# Altium project PCBX-1.PrjPcb
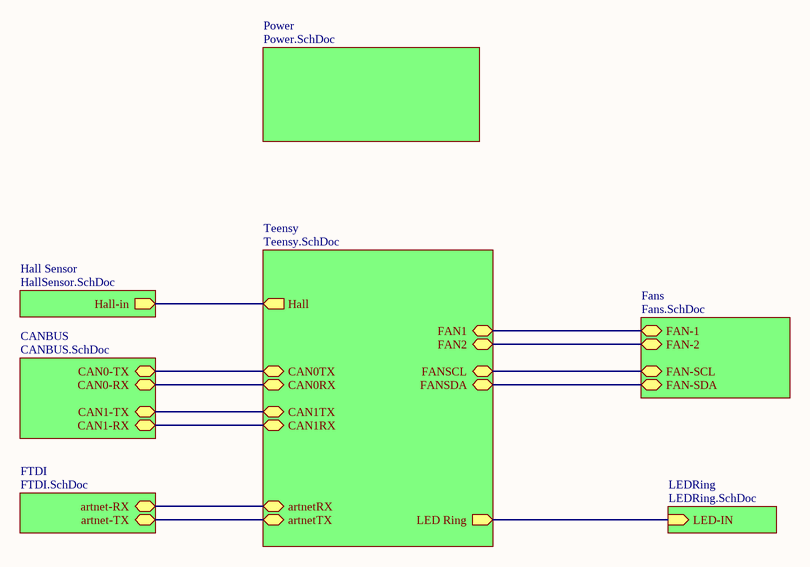
[diagram p0: LX1_v1.SchDoc]
11 sheets, 112 parts. Net scope: hierarchical (ports join the sheet entries above them; power ports are global).
Sheets:
  LX1_v1.SchDoc
    Teensy = Teensy.SchDoc
    LEDRing = LEDRing.SchDoc
    Fans = Fans.SchDoc
    FTDI = FTDI.SchDoc
    Power = Power.SchDoc
    Hall Sensor = HallSensor.SchDoc
    CANBUS = CANBUS.SchDoc
  ODrive.SchDoc
  RZ120.SchDoc
  PowerOld.SchDoc

## Sheet LX1_v1.SchDoc: LX-1
size A4; Organization: Carbon Video Systems; Address1: 1265 Powell Street; Address2: Vancouver, BC; Address3: Canada; Revision: 0.1; SheetNumber: 1

### Sub-sheets
CANBUS = CANBUS.SchDoc: CAN0-TX, CAN0-RX, CAN1-TX, CAN1-RX
Fans = Fans.SchDoc: FAN-1, FAN-2, FAN-SCL, FAN-SDA
FTDI = FTDI.SchDoc: artnet-RX, artnet-TX
Hall Sensor = HallSensor.SchDoc: Hall-in
LEDRing = LEDRing.SchDoc: LED-IN (in)
Power = Power.SchDoc: no entries
Teensy = Teensy.SchDoc: LED Ring (out), FAN1, FAN2, FANSDA, FANSCL, artnetTX, artnetRX, Hall, CAN0TX, CAN0RX, CAN1TX, CAN1RX

### Nets
NetARM_Teensy_A5: sheet Teensy/LED Ring, sheet LEDRing/LED-IN
NetARM_Teensy_A8: sheet Teensy/Hall, sheet Hall Sensor/Hall-in
NetARM_Teensy_A9: sheet Teensy/artnetTX, sheet FTDI/artnet-TX
NetARM_Teensy_A11: sheet Teensy/artnetRX, sheet FTDI/artnet-RX
NetARM_Teensy_D11: sheet Teensy/FAN2, sheet Fans/FAN-2
NetARM_Teensy_D12: sheet Teensy/FAN1, sheet Fans/FAN-1
NetARM_Teensy_G11: sheet Teensy/FANSDA, sheet Fans/FAN-SDA
NetARM_Teensy_G12: sheet Teensy/FANSCL, sheet Fans/FAN-SCL
NetARM_Teensy_J9: sheet Teensy/CAN0RX, sheet CANBUS/CAN0-RX
NetARM_Teensy_K5: sheet Teensy/CAN1RX, sheet CANBUS/CAN1-RX
NetARM_Teensy_K9: sheet Teensy/CAN0TX, sheet CANBUS/CAN0-TX
NetARM_Teensy_M4: sheet Teensy/CAN1TX, sheet CANBUS/CAN1-TX

### Notes on the sheet
- Title
- Size:
- Date:
- A4
- Number:
- Time:
- Revision:
- Sheet
- of
- File:

## Sheet Teensy.SchDoc
size A2; Organization: Altium Limited; Address1: L3, 12a Rodborough Rd; Address2: Frenchs Forest; Address3: NSW; Address4: Australia 2086
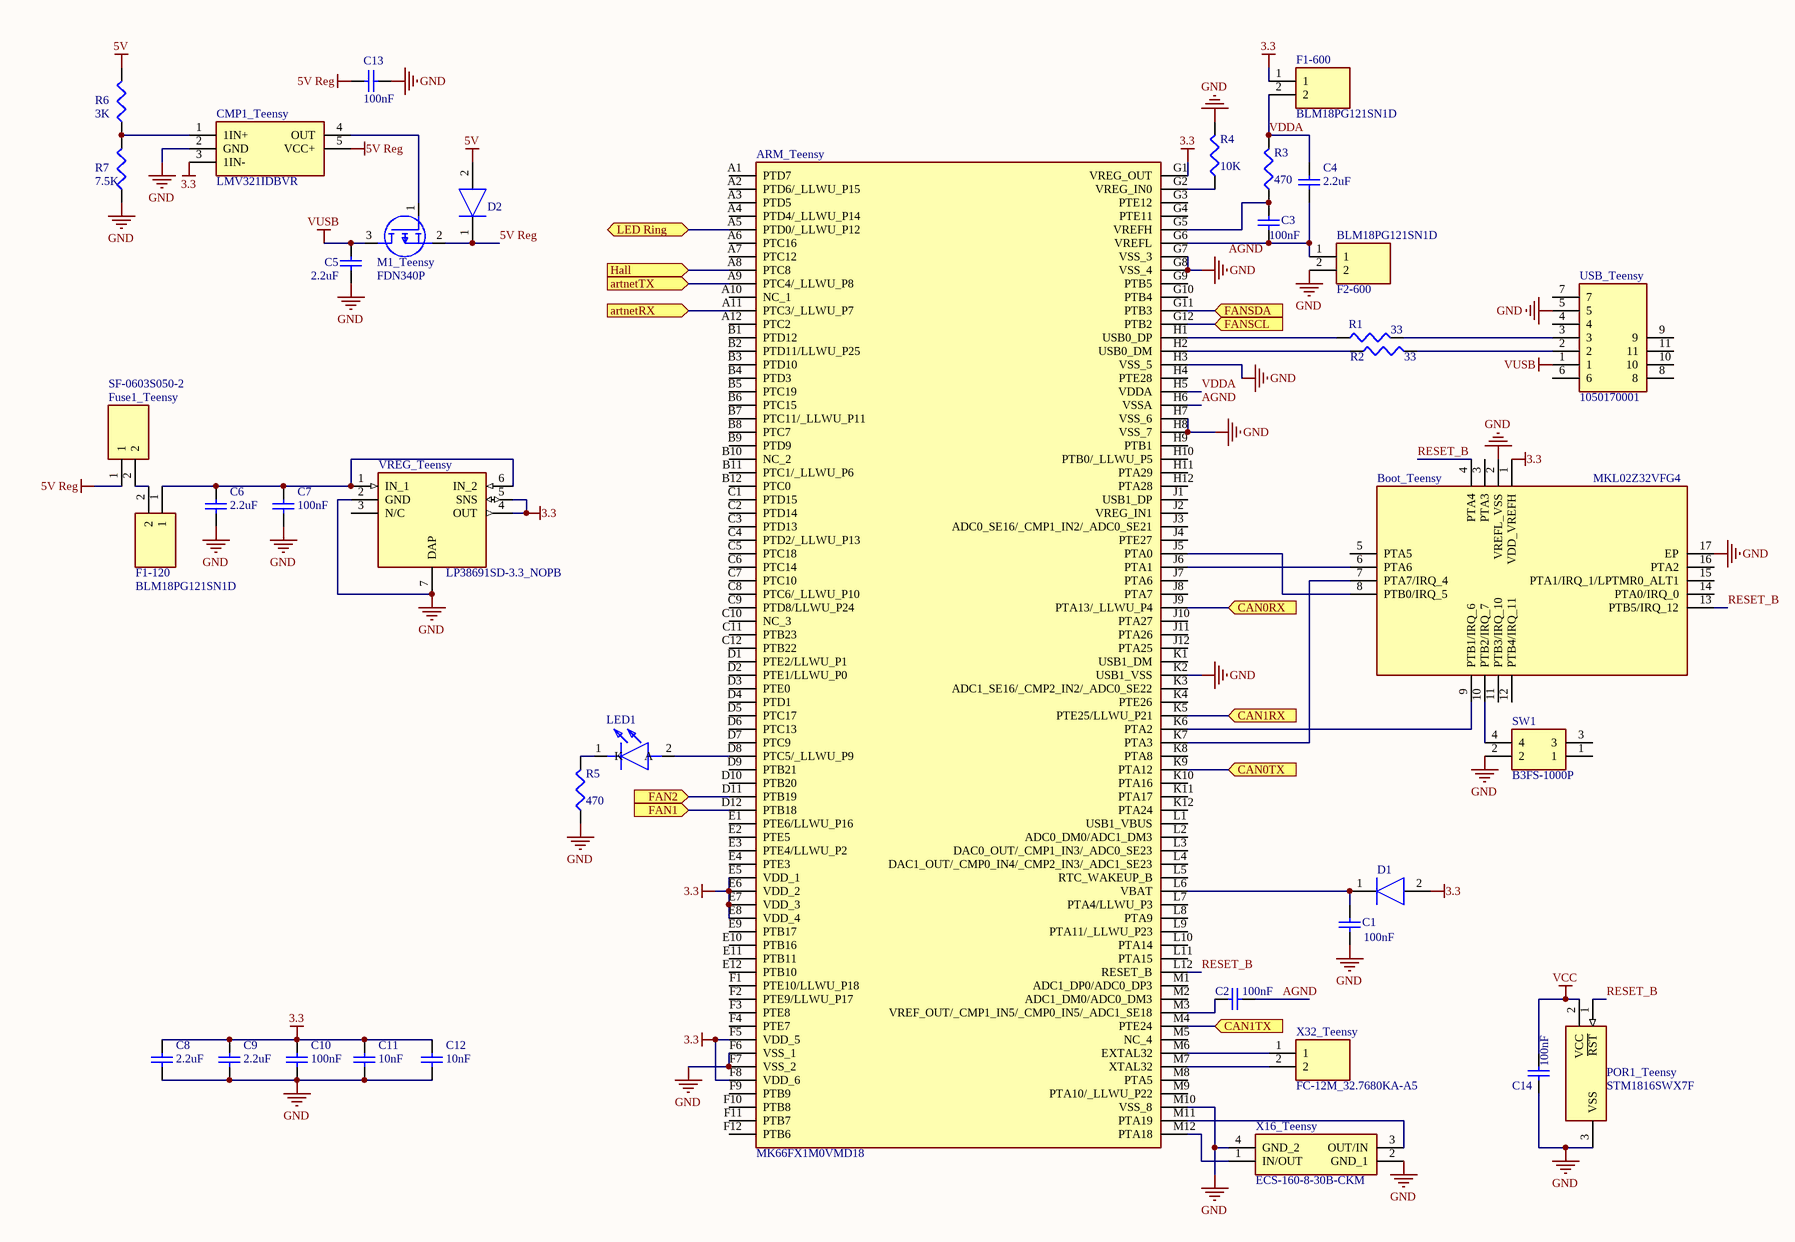
[diagram p1: Teensy.SchDoc]

### Parts
ARM_Teensy  MK66FX1M0VMD18  [BGA144C100P12X12_1300X1300X170]
Boot_Teensy  MKL02Z32VFG4  [QFN50P300X300X65-17N-D]
C1  value 100nF  [1608[0603]]  (hidden comment: Cap Semi)
C2  value 100nF  [1608[0603]]  (hidden comment: Cap Semi)
C3  value 100nF  [1608[0603]]  (hidden comment: Cap Semi)
C4  value 2.2uF  [1608[0603]]  (hidden comment: Cap Semi)
C5  value 2.2uF  [1608[0603]]  (hidden comment: Cap Semi)
C6  value 2.2uF  [1608[0603]]  (hidden comment: Cap Semi)
C7  value 100nF  [1608[0603]]  (hidden comment: Cap Semi)
C8  value 2.2uF  [1608[0603]]  (hidden comment: Cap Semi)
C9  value 2.2uF  [1608[0603]]  (hidden comment: Cap Semi)
C10  value 100nF  [1608[0603]]  (hidden comment: Cap Semi)
C11  value 10nF  [1608[0603]]  (hidden comment: Cap Semi)
C12  value 10nF  [1608[0603]]  (hidden comment: Cap Semi)
C13  value 100nF  [1608[0603]]  (hidden comment: Cap Semi)
C14  value 100nF  [1608[0603]]  (hidden comment: Cap Semi)
CMP1_Teensy  LMV321IDBVR  [SOT95P280X145-5N]
D1  NRVTS260ESFT1G  [SODFL3616X98N]  (value not drawn)
D2  NRVTS260ESFT1G  [SODFL3616X98N]  (value not drawn)
F1-120  BLM18PG121SN1D  [BEADC1608X95N]
F1-600  BLM18PG121SN1D  [BEADC1608X95N]
F2-600  BLM18PG121SN1D  [BEADC1608X95N]
Fuse1_Teensy  SF-0603S050-2  [FUSC1608X55N]
LED1  HSMC-C190  [LEDC1608X90N]  (value not drawn)
M1_Teensy  FDN340P  [SOT95P237X112-3N]
POR1_Teensy  STM1816SWX7F  [SOT103P237X112-3N]
R1  value 33  [J1-0603]  (hidden comment: Res3)
R2  value 33  [J1-0603]  (hidden comment: Res3)
R3  value 470  [J1-0603]  (hidden comment: Res3)
R4  value 10K  [J1-0603]  (hidden comment: Res3)
R5  value 470  [J1-0603]  (hidden comment: Res3)
R6  value 3K  [J1-0603]  (hidden comment: Res3)
R7  value 7.5K  [J1-0603]  (hidden comment: Res3)
SW1  B3FS-1000P  [B3FS-1000P]
USB_Teensy  1050170001  [MICROUSB-BTYPE]
VREG_Teensy  LP38691SD-3.3_NOPB  [SON95P300X300X80-7N]
X16_Teensy  ECS-160-8-30B-CKM  [ECS801830BAGNTR]
X32_Teensy  FC-12M_32.7680KA-A5  [FC12M327680KAA5]

### Ports
artnetRX, artnetTX, CAN0RX, CAN0TX, CAN1RX, CAN1TX, FAN1, FAN2, FANSCL, FANSDA, Hall, LED Ring

### Nets
3.3: ARM_Teensy.E5(VDD_1) ARM_Teensy.E6(VDD_2) ARM_Teensy.E7(VDD_3) ARM_Teensy.E8(VDD_4) ARM_Teensy.F5(VDD_5) ARM_Teensy.F8(VDD_6) ARM_Teensy.G1(VREG_OUT) Boot_Teensy.1(VDD_VREFH) C8.2 C9.2 C10.2 C11.2 C12.2 CMP1_Teensy.3(1IN-) D1.2(A) F1-600.1 VREG_Teensy.4(OUT) VREG_Teensy.5(SNS)
5V: D2.2(A) R6.2
5V Reg: C13.2 CMP1_Teensy.5(VCC+) D2.1(K) Fuse1_Teensy.1 M1_Teensy.2(S)
GND: ARM_Teensy.F6(VSS_1) ARM_Teensy.F7(VSS_2) ARM_Teensy.G7(VSS_3) ARM_Teensy.G8(VSS_4) ARM_Teensy.H3(VSS_5) ARM_Teensy.H7(VSS_6) ARM_Teensy.H8(VSS_7) ARM_Teensy.K2(USB1_VSS) ARM_Teensy.M10(VSS_8) Boot_Teensy.2(VREFL_VSS) Boot_Teensy.17(EP) C1.1 C5.2 C6.1 C7.1 C8.1 C9.1 C10.1 C11.1 C12.1 C13.1 C14.1 CMP1_Teensy.2(GND) F2-600.2 POR1_Teensy.3(VSS) R4.2 R5.1 R7.1 SW1.2 USB_Teensy.5 VREG_Teensy.2(GND) VREG_Teensy.7(DAP) X16_Teensy.2(GND_1) X16_Teensy.4(GND_2)
VCC: C14.2 POR1_Teensy.2(VCC)
VUSB: C5.1 M1_Teensy.3(D) USB_Teensy.1
AGND: ARM_Teensy.H6(VSSA) C2.2
RESET_B: ARM_Teensy.L12(RESET_B) Boot_Teensy.4(PTA4) Boot_Teensy.13(PTB5/IRQ_12) POR1_Teensy.1(~{RST})
VDDA: ARM_Teensy.H5(VDDA) C4.2 F1-600.2 R3.2
NetARM_Teensy_A5: ARM_Teensy.A5(PTD0/_LLWU_P12) ; port LED Ring
NetARM_Teensy_A8: ARM_Teensy.A8(PTC8) ; port Hall
NetARM_Teensy_A9: ARM_Teensy.A9(PTC4/_LLWU_P8) ; port artnetTX
NetARM_Teensy_A11: ARM_Teensy.A11(PTC3/_LLWU_P7) ; port artnetRX
NetARM_Teensy_D8: ARM_Teensy.D8(PTC5/_LLWU_P9) LED1.2(A)
NetARM_Teensy_D11: ARM_Teensy.D11(PTB19) ; port FAN2
NetARM_Teensy_D12: ARM_Teensy.D12(PTB18) ; port FAN1
NetARM_Teensy_G2: ARM_Teensy.G2(VREG_IN0) R4.1
NetARM_Teensy_G5: ARM_Teensy.G5(VREFH) C3.2 R3.1
NetARM_Teensy_G6: ARM_Teensy.G6(VREFL) C3.1 C4.1 F2-600.1
NetARM_Teensy_G11: ARM_Teensy.G11(PTB3) ; port FANSDA
NetARM_Teensy_G12: ARM_Teensy.G12(PTB2) ; port FANSCL
NetARM_Teensy_H1: ARM_Teensy.H1(USB0_DP) R1.1
NetARM_Teensy_H2: ARM_Teensy.H2(USB0_DM) R2.1
NetARM_Teensy_J5: ARM_Teensy.J5(PTA0) Boot_Teensy.8(PTB0/IRQ_5)
NetARM_Teensy_J6: ARM_Teensy.J6(PTA1) Boot_Teensy.6(PTA6)
NetARM_Teensy_J9: ARM_Teensy.J9(PTA13/_LLWU_P4) ; port CAN0RX
NetARM_Teensy_K5: ARM_Teensy.K5(PTE25/LLWU_P21) ; port CAN1RX
NetARM_Teensy_K6: ARM_Teensy.K6(PTA2) Boot_Teensy.9(PTB1/IRQ_6)
NetARM_Teensy_K7: ARM_Teensy.K7(PTA3) Boot_Teensy.7(PTA7/IRQ_4)
NetARM_Teensy_K9: ARM_Teensy.K9(PTA12) ; port CAN0TX
NetARM_Teensy_L6: ARM_Teensy.L6(VBAT) C1.2 D1.1(K)
NetARM_Teensy_M3: ARM_Teensy.M3(VREF_OUT/_CMP1_IN5/_CMP0_IN5/_ADC1_SE18) C2.1
NetARM_Teensy_M4: ARM_Teensy.M4(PTE24) ; port CAN1TX
NetARM_Teensy_M6: ARM_Teensy.M6(EXTAL32) X32_Teensy.1
NetARM_Teensy_M7: ARM_Teensy.M7(XTAL32) X32_Teensy.2
NetARM_Teensy_M11: ARM_Teensy.M11(PTA19) X16_Teensy.3(OUT/IN)
NetARM_Teensy_M12: ARM_Teensy.M12(PTA18) X16_Teensy.1(IN/OUT)
NetBoot_Teensy_10: Boot_Teensy.10(PTB2/IRQ_7) SW1.4
NetC6_2: C6.2 C7.2 F1-120.1 VREG_Teensy.1(IN_1) VREG_Teensy.6(IN_2)
NetCMP1_Teensy_1: CMP1_Teensy.1(1IN+) R6.1 R7.2
NetCMP1_Teensy_4: CMP1_Teensy.4(OUT) M1_Teensy.1(G)
NetF1-120_2: F1-120.2 Fuse1_Teensy.2
NetLED1_1: LED1.1(K) R5.2
NetR1_2: R1.2 USB_Teensy.3
NetR2_2: R2.2 USB_Teensy.2

Not connected (* = marked no-connect by the designer): ARM_Teensy A1(PTD7) A2(PTD6/_LLWU_P15) A3(PTD5) A4(PTD4/_LLWU_P14) A6(PTC16) A7(PTC12) A10(NC_1) A12(PTC2) B1(PTD12) B2(PTD11/LLWU_P25) B3(PTD10) B4(PTD3) B5(PTC19) B6(PTC15) B7(PTC11/_LLWU_P11) B8(PTC7) B9(PTD9) B10(NC_2) B11(PTC1/_LLWU_P6) B12(PTC0) C1(PTD15) C2(PTD14) C3(PTD13) C4(PTD2/_LLWU_P13) C5(PTC18) C6(PTC14) C7(PTC10) C8(PTC6/_LLWU_P10) C9(PTD8/LLWU_P24) C10(NC_3) C11(PTB23) C12(PTB22) D1(PTE2/LLWU_P1) D2(PTE1/LLWU_P0) D3(PTE0) D4(PTD1) D5(PTC17) D6(PTC13) D7(PTC9) D9(PTB21) D10(PTB20) E1(PTE6/LLWU_P16) E2(PTE5) E3(PTE4/LLWU_P2) E4(PTE3) E9(PTB17) E10(PTB16) E11(PTB11) E12(PTB10) F1(PTE10/LLWU_P18) F2(PTE9/LLWU_P17) F3(PTE8) F4(PTE7) F9(PTB9) F10(PTB8) F11(PTB7) F12(PTB6) G3(PTE12) G4(PTE11) G9(PTB5) G10(PTB4) H4(PTE28) H9(PTB1) H10(PTB0/_LLWU_P5) H11(PTA29) H12(PTA28) J1(USB1_DP) J2(VREG_IN1) J3(ADC0_SE16/_CMP1_IN2/_ADC0_SE21) J4(PTE27) J7(PTA6) J8(PTA7) J10(PTA27) J11(PTA26) J12(PTA25) K1(USB1_DM) K3(ADC1_SE16/_CMP2_IN2/_ADC0_SE22) K4(PTE26) K8(PTA8) K10(PTA16) K11(PTA17) K12(PTA24) L1(USB1_VBUS) L2(ADC0_DM0/ADC1_DM3) L3(DAC0_OUT/_CMP1_IN3/_ADC0_SE23) L4(DAC1_OUT/_CMP0_IN4/_CMP2_IN3/_ADC1_SE23) L5(RTC_WAKEUP_B) L7(PTA4/LLWU_P3) L8(PTA9) L9(PTA11/_LLWU_P23) L10(PTA14) L11(PTA15) M1(ADC1_DP0/ADC0_DP3) M2(ADC1_DM0/ADC0_DM3) M5(NC_4) M8(PTA5) M9(PTA10/_LLWU_P22); Boot_Teensy 3(PTA3) 5(PTA5) 11(PTB3/IRQ_10) 12(PTB4/IRQ_11) 14(PTA0/IRQ_0) 15(PTA1/IRQ_1/LPTMR0_ALT1) 16(PTA2); SW1 1 3; USB_Teensy 4 6 7 8 9 10 11; VREG_Teensy 3(N/C)

### Notes on the sheet
- Labels drawn without touching a wire or pin: AGND
- Title
- Size:
- Date:
- File:
- A2
- Number:
- Time:
- Revision:
- Sheet
- of

### Library data of the parts
ARM_Teensy = MK66FX1M0VMD18: Integrated Circuit; Manufacturer_Name: Nexperia; Datasheet Link: https://componentsearchengine.com/Datasheets/2/MK66FX1M0VMD18.pdf; Height: 1.7mm; Manufacturer_Part_Number: MK66FX1M0VMD18; Mouser Part Number: 841-MK66FX1M0VMD18; Mouser Price/Stock: https://www.mouser.com/Search/Refine.aspx?Keyword=841-MK66FX1M0VMD18
Boot_Teensy = MKL02Z32VFG4: Integrated Circuit; Manufacturer_Name: Nexperia; Datasheet Link: https://www.nxp.com/docs/en/data-sheet/KL02P32M48SF0.pdf; Height: 0.65mm; Manufacturer_Part_Number: MKL02Z32VFG4; Mouser Part Number: 841-MKL02Z32VFG4; Mouser Price/Stock: https://www.mouser.com/Search/Refine.aspx?Keyword=841-MKL02Z32VFG4; RS Part Number: 7884723P; RS Price/Stock: http://uk.rs-online.com/web/p/products/7884723P
C1-C14 = Cap Semi: Capacitor (Semiconductor SIM Model); Published: 8-Jun-2000; LatestRevisionDate: 29-May-2009; LatestRevisionNote: IPC-7351 Footprint Added.; PackageReference: C1206; Publisher: Altium Limited; PackageDescription: Chip Capacitor
CMP1_Teensy = LMV321IDBVR: Integrated Circuit; Manufacturer_Name: Texas Instruments; Datasheet Link: http://www.ti.com/lit/gpn/lmv321; Height: 1.45mm; Manufacturer_Part_Number: LMV321IDBVR; Mouser Part Number: 595-LMV321IDBVR; Mouser Price/Stock: https://www.mouser.com/Search/Refine.aspx?Keyword=595-LMV321IDBVR
D1 D2 = NRVTS260ESFT1G: Diode; Manufacturer_Name: ON Semiconductor; Allied_Number: 70600214; Datasheet Link: http://www.onsemi.com/pub/Collateral/NTS260ESF-D.PDF; Height: 0.98mm; Manufacturer_Part_Number: NRVTS260ESFT1G; Mouser Part Number: 863-NRVTS260ESFT1G; Mouser Price/Stock: https://www.mouser.com/Search/Refine.aspx?Keyword=863-NRVTS260ESFT1G; RS Part Number: 8673243P; RS Price/Stock: http://uk.rs-online.com/web/p/products/8673243P; Allied Price/Stock: http://www.alliedelec.com/on-semiconductor-nrvts260esft1g/70600214/
F1-120 F1-600 F2-600 = BLM18PG121SN1D: Filter; Manufacturer_Name: Murata Electronics; Datasheet Link: https://www.murata.com/en-us/products/productdetail?partno=BLM18PG121SN1%23; Height: 0.95mm; Manufacturer_Part_Number: BLM18PG121SN1D; Mouser Part Number: 81-BLM18PG121SN1D; Mouser Price/Stock: https://www.mouser.com/Search/Refine.aspx?Keyword=81-BLM18PG121SN1D; RS Part Number: 7241380P; RS Price/Stock: http://uk.rs-online.com/web/p/products/7241380P
Fuse1_Teensy = SF-0603S050-2: Fuse; Manufacturer_Name: Bourns; Allied_Number: 71279504; Datasheet Link: https://www.bourns.com/docs/Product-Datasheets/sf0603s.pdf; Height: 0.55mm; Manufacturer_Part_Number: SF-0603S050-2; Mouser Part Number: 652-SF-0603S050-2; Mouser Price/Stock: https://www.mouser.com/Search/Refine.aspx?Keyword=652-SF-0603S050-2; RS Part Number: 8978989P; RS Price/Stock: http://uk.rs-online.com/web/p/products/8978989P; Allied Price/Stock: https://www.alliedelec.com/bourns-sf-0603s050-2/71279504/
LED1 = HSMC-C190: LED; Manufacturer_Name: Avago Technologies; Datasheet Link: http://www.mouser.hk/ProductDetail/Broadcom-Avago/HSMC-C190/?qs=YDL0qNrpDT4TTmzDJNXHWQ==; Height: 0.9mm; Manufacturer_Part_Number: HSMC-C190; Mouser Part Number: 630-HSMC-C190; Mouser Price/Stock: https://www.mouser.com/Search/Refine.aspx?Keyword=630-HSMC-C190; RS Part Number: 6910391P; RS Price/Stock: http://uk.rs-online.com/web/p/products/6910391P
M1_Teensy = FDN340P: MOSFET (P-Channel); Manufacturer_Name: ON Semiconductor; Datasheet Link: https://www.onsemi.com/pub/Collateral/FDN340P-D.PDF; Height: 1.12mm; Manufacturer_Part_Number: FDN340P; Mouser Part Number: 512-FDN340P; Mouser Price/Stock: https://www.mouser.com/Search/Refine.aspx?Keyword=512-FDN340P; RS Part Number: 6710435P; RS Price/Stock: http://uk.rs-online.com/web/p/products/6710435P
POR1_Teensy = STM1816SWX7F: Integrated Circuit; Manufacturer_Name: STMicroelectronics; Allied_Number: 70014047; Datasheet Link: http://www.st.com/st-web-ui/static/active/en/resource/technical/document/datasheet/CD00059921.pdf; Height: 1.12mm; Manufacturer_Part_Number: STM1816SWX7F; Mouser Part Number: 511-STM1816SWX7F; Mouser Price/Stock: https://www.mouser.com/Search/Refine.aspx?Keyword=511-STM1816SWX7F; RS Part Number: 6248264; RS Price/Stock: http://uk.rs-online.com/web/p/products/6248264; Allied Price/Stock: http://www.alliedelec.com/stmicroelectronics-stm1816swx7f/70014047/
R1-R7 = Res3: Resistor; Published: 8-Jun-2000; LatestRevisionDate: 29-May-2009; LatestRevisionNote: IPC-7351 Footprint Added.; PackageReference: J1-0603; Publisher: Altium Limited; PackageDescription: Chip Resistor
SW1 = B3FS-1000P: Switch; Manufacturer_Name: Omron Electronics; Allied_Number: 70175891; Datasheet Link: https://www.omron.co.jp/ecb/products/pdf/b3fs.pdf; Manufacturer_Part_Number: B3FS-1000P; Mouser Part Number: 653-B3FS-1000P; Mouser Price/Stock: https://www.mouser.com/Search/Refine.aspx?Keyword=653-B3FS-1000P; RS Part Number: 6821254P; RS Price/Stock: http://uk.rs-online.com/web/p/products/6821254P; Allied Price/Stock: http://www.alliedelec.com/omron-electronic-components-b3fs-1000p/70175891/
USB_Teensy = 1050170001: Connector; Manufacturer_Name: Molex; Datasheet Link: http://www.mouser.com/ds/2/276/1050170001_IO_CONNECTORS-230168.pdf; Manufacturer_Part_Number: 1050170001; Mouser Part Number: N/A; Mouser Price/Stock: https://www.mouser.com/Search/Refine.aspx?Keyword=N%2FA
VREG_Teensy = LP38691SD-3.3_NOPB: Power Supply; Manufacturer_Name: Texas Instruments; Manufacturer_Part_Number: LP38691SD-3.3/NOPB; Datasheet Link: http://www.ti.com/lit/ds/symlink/lp38693-q1.pdf; Height: 0.8mm; Mouser Part Number: 926-38691SD-3.3/NOPB; Mouser Price/Stock: https://www.mouser.com/Search/Refine.aspx?Keyword=926-38691SD-3.3%2FNOPB; RS Part Number: 7616605P; RS Price/Stock: http://uk.rs-online.com/web/p/products/7616605P
X16_Teensy = ECS-160-8-30B-CKM: Crystal or Oscillator; Manufacturer_Name: ECS; Datasheet Link: https://ecsxtal.com/store/pdf/ecx_53b.pdf; Height: 0.85mm; Manufacturer_Part_Number: ECS-160-8-30B-CKM; Mouser Part Number: 520-160-8-30B-CKM; Mouser Price/Stock: https://www.mouser.com/Search/Refine.aspx?Keyword=520-160-8-30B-CKM
X32_Teensy = FC-12M_32.7680KA-A5: Crystal or Oscillator; Manufacturer_Name: Epson Timing; Manufacturer_Part_Number: FC-12M 32.7680KA-A5; Datasheet Link: https://support.epson.biz/td/api/doc_check.php?dl=brief_FC-12D&lang=en; Height: 0.6mm; Mouser Part Number: 732-FC-12M32.768KAA5; Mouser Price/Stock: https://www.mouser.com/Search/Refine.aspx?Keyword=732-FC-12M32.768KAA5

## Sheet LEDRing.SchDoc
size A4; Organization: Altium Limited; Address1: L3, 12a Rodborough Rd; Address2: Frenchs Forest; Address3: NSW; Address4: Australia 2086
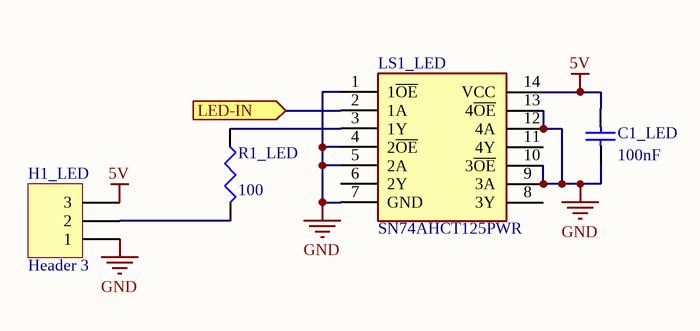
[diagram p2: LEDRing.SchDoc]

### Parts
C1_LED  value 100nF  [1608[0603]]  (hidden comment: Cap Semi)
H1_LED  Header 3  [HDR1X3]
LS1_LED  SN74AHCT125PWR  [SOP65P640X120-14N]
R1_LED  value 100  [J1-0603]  (hidden comment: Res3)

### Ports
LED-IN

### Nets
5V: C1_LED.2 H1_LED.3 LS1_LED.14(VCC)
GND: C1_LED.1 H1_LED.1 LS1_LED.1(1~{OE}) LS1_LED.4(2~{OE}) LS1_LED.5(2A) LS1_LED.7(GND) LS1_LED.9(3A) LS1_LED.10(3~{OE}) LS1_LED.12(4A) LS1_LED.13(4~{OE})
NetARM_Teensy_A5: LS1_LED.2(1A) ; port LED-IN
NetH1_LED_2: H1_LED.2 R1_LED.2
NetLS1_LED_3: LS1_LED.3(1Y) R1_LED.1

Not connected (* = marked no-connect by the designer): LS1_LED 6(2Y) 8(3Y) 11(4Y)

### Notes on the sheet
- Title
- Size:
- Date:
- A4
- Number:
- Time:
- Revision:
- Sheet
- of
- File:

### Library data of the parts
C1_LED = Cap Semi: Capacitor (Semiconductor SIM Model); Published: 8-Jun-2000; LatestRevisionDate: 29-May-2009; LatestRevisionNote: IPC-7351 Footprint Added.; PackageReference: C1206; Publisher: Altium Limited; PackageDescription: Chip Capacitor
H1_LED = Header 3: Header, 3-Pin; LatestRevisionDate: 17-Jul-2002; LatestRevisionNote: Re-released for DXP Platform.; Publisher: Altium Limited
LS1_LED = SN74AHCT125PWR: Integrated Circuit; Manufacturer_Name: Texas Instruments; Datasheet Link: http://www.ti.com/lit/gpn/sn74ahct125; Height: 1.2mm; Manufacturer_Part_Number: SN74AHCT125PWR; Mouser Part Number: 595-SN74AHCT125PWR; Mouser Price/Stock: https://www.mouser.com/Search/Refine.aspx?Keyword=595-SN74AHCT125PWR
R1_LED = Res3: Resistor; Published: 8-Jun-2000; LatestRevisionDate: 29-May-2009; LatestRevisionNote: IPC-7351 Footprint Added.; PackageReference: J1-0603; Publisher: Altium Limited; PackageDescription: Chip Resistor

## Sheet Fans.SchDoc
size A4; Organization: Altium Limited; Address1: L3, 12a Rodborough Rd; Address2: Frenchs Forest; Address3: NSW; Address4: Australia 2086
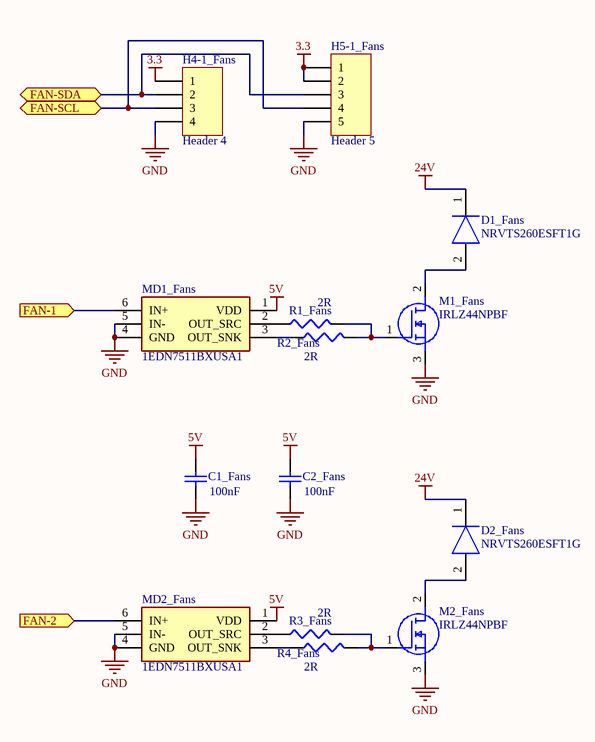
[diagram p3: Fans.SchDoc]

### Parts
C1_Fans  value 100nF  [1608[0603]]  (hidden comment: Cap Semi)
C2_Fans  value 100nF  [1608[0603]]  (hidden comment: Cap Semi)
D1_Fans  NRVTS260ESFT1G  [SODFL3616X98N]
D2_Fans  NRVTS260ESFT1G  [SODFL3616X98N]
H4-1_Fans  Header 4  [HDR1X4]
H5-1_Fans  Header 5  [HDR1X5]
M1_Fans  IRLZ44NPBF  [TO254P469X1042X1967-3P]
M2_Fans  IRLZ44NPBF  [TO254P469X1042X1967-3P]
MD1_Fans  1EDN7511BXUSA1  [SOT95P280X145-6N]
MD2_Fans  1EDN7511BXUSA1  [SOT95P280X145-6N]
R1_Fans  value 2R  [J1-0603]  (hidden comment: Res3)
R2_Fans  value 2R  [J1-0603]  (hidden comment: Res3)
R3_Fans  value 2R  [J1-0603]  (hidden comment: Res3)
R4_Fans  value 2R  [J1-0603]  (hidden comment: Res3)

### Ports
FAN-1, FAN-2, FAN-SCL, FAN-SDA

### Nets
3.3: H4-1_Fans.1 H5-1_Fans.1 H5-1_Fans.2
5V: C1_Fans.2 C2_Fans.2 MD1_Fans.1(VDD) MD2_Fans.1(VDD)
24V: D1_Fans.1(K) D2_Fans.1(K)
GND: C1_Fans.1 C2_Fans.1 H4-1_Fans.4 H5-1_Fans.5 M1_Fans.3(S) M2_Fans.3(S) MD1_Fans.4(GND) MD1_Fans.5(IN-) MD2_Fans.4(GND) MD2_Fans.5(IN-)
NetARM_Teensy_D11: MD2_Fans.6(IN+) ; port FAN-2
NetARM_Teensy_D12: MD1_Fans.6(IN+) ; port FAN-1
NetARM_Teensy_G11: H4-1_Fans.2 H5-1_Fans.3 ; port FAN-SDA
NetARM_Teensy_G12: H4-1_Fans.3 H5-1_Fans.4 ; port FAN-SCL
NetD1_Fans_2: D1_Fans.2(A) M1_Fans.2(D)
NetD2_Fans_2: D2_Fans.2(A) M2_Fans.2(D)
NetM1_Fans_1: M1_Fans.1(G) R1_Fans.2 R2_Fans.2
NetM2_Fans_1: M2_Fans.1(G) R3_Fans.2 R4_Fans.2
NetMD1_Fans_2: MD1_Fans.2(OUT_SRC) R1_Fans.1
NetMD1_Fans_3: MD1_Fans.3(OUT_SNK) R2_Fans.1
NetMD2_Fans_2: MD2_Fans.2(OUT_SRC) R3_Fans.1
NetMD2_Fans_3: MD2_Fans.3(OUT_SNK) R4_Fans.1

### Notes on the sheet
- Title
- Size:
- Date:
- A4
- Number:
- Time:
- Revision:
- Sheet
- of
- File:

### Library data of the parts
C1_Fans C2_Fans = Cap Semi: Capacitor (Semiconductor SIM Model); Published: 8-Jun-2000; LatestRevisionDate: 29-May-2009; LatestRevisionNote: IPC-7351 Footprint Added.; PackageReference: C1206; Publisher: Altium Limited; PackageDescription: Chip Capacitor
D1_Fans D2_Fans = NRVTS260ESFT1G: as D1 on sheet Teensy; Datasheet Link: http://www.onsemi.com/pub/Collateral/NTS260ESF-D.PDF; Height: 0.98mm; Manufacturer_Part_Number: NRVTS260ESFT1G; Mouser Part Number: 863-NRVTS260ESFT1G; Mouser Price/Stock: https://www.mouser.com/Search/Refine.aspx?Keyword=863-NRVTS260ESFT1G; RS Part Number: 8673243P; RS Price/Stock: http://uk.rs-online.com/web/p/products/8673243P; Allied Price/Stock: http://www.alliedelec.com/on-semiconductor-nrvts260esft1g/70600214/
H4-1_Fans = Header 4: Header, 4-Pin; LatestRevisionDate: 17-Jul-2002; LatestRevisionNote: Re-released for DXP Platform.; Publisher: Altium Limited
H5-1_Fans = Header 5: Header, 5-Pin; LatestRevisionDate: 17-Jul-2002; LatestRevisionNote: Re-released for DXP Platform.; Publisher: Altium Limited
M1_Fans M2_Fans = IRLZ44NPBF: MOSFET (N-Channel); Manufacturer_Name: Infineon; Allied_Number: 70017121; Datasheet Link: https://www.mouser.co.uk/datasheet/2/196/irlz44npbf-1228134.pdf; Height: 4.69mm; Manufacturer_Part_Number: IRLZ44NPBF; Mouser Part Number: 942-IRLZ44NPBF; Mouser Price/Stock: https://www.mouser.com/Search/Refine.aspx?Keyword=942-IRLZ44NPBF; RS Part Number: 5410086P; RS Price/Stock: http://uk.rs-online.com/web/p/products/5410086P; Allied Price/Stock: https://www.alliedelec.com/infineon-irlz44npbf/70017121/
MD1_Fans MD2_Fans = 1EDN7511BXUSA1: Integrated Circuit; Manufacturer_Name: Infineon; Datasheet Link: https://componentsearchengine.com/Datasheets/1/1EDN7511BXUSA1.pdf; Height: 1.45mm; Manufacturer_Part_Number: 1EDN7511BXUSA1; Mouser Part Number: 726-1EDN7511BXUSA1; Mouser Price/Stock: https://www.mouser.com/Search/Refine.aspx?Keyword=726-1EDN7511BXUSA1
R1_Fans R2_Fans R3_Fans R4_Fans = Res3: Resistor; Published: 8-Jun-2000; LatestRevisionDate: 29-May-2009; LatestRevisionNote: IPC-7351 Footprint Added.; PackageReference: J1-0603; Publisher: Altium Limited; PackageDescription: Chip Resistor

## Sheet FTDI.SchDoc
size A4; Organization: Altium Limited; Address1: L3, 12a Rodborough Rd; Address2: Frenchs Forest; Address3: NSW; Address4: Australia 2086
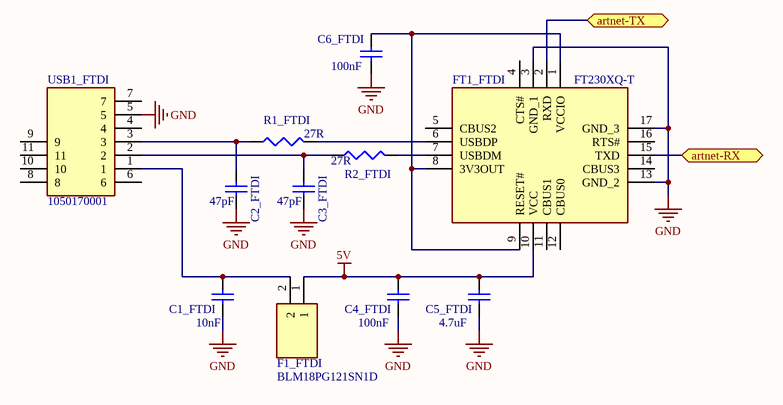
[diagram p4: FTDI.SchDoc]

### Parts
C1_FTDI  value 10nF  [1608[0603]]  (hidden comment: Cap Semi)
C2_FTDI  value 47pF  [1608[0603]]  (hidden comment: Cap Semi)
C3_FTDI  value 47pF  [1608[0603]]  (hidden comment: Cap Semi)
C4_FTDI  value 100nF  [1608[0603]]  (hidden comment: Cap Semi)
C5_FTDI  value 4.7uF  [1608[0603]]  (hidden comment: Cap Semi)
C6_FTDI  value 100nF  [1608[0603]]  (hidden comment: Cap Semi)
F1_FTDI  BLM18PG121SN1D  [BEADC1608X95N]
FT1_FTDI  FT230XQ-T  [QFN65P400X400X80-17N]
R1_FTDI  value 27R  [J1-0603]  (hidden comment: Res3)
R2_FTDI  value 27R  [J1-0603]  (hidden comment: Res3)
USB1_FTDI  1050170001  [MICROUSB-BTYPE]

### Ports
artnet-RX, artnet-TX

### Nets
5V: C4_FTDI.2 C5_FTDI.2 F1_FTDI.1 FT1_FTDI.10(VCC)
GND: C1_FTDI.1 C2_FTDI.1 C3_FTDI.1 C4_FTDI.1 C5_FTDI.1 C6_FTDI.2 FT1_FTDI.3(GND_1) FT1_FTDI.13(GND_2) FT1_FTDI.17(GND_3) USB1_FTDI.5
NetARM_Teensy_A9: FT1_FTDI.2(RXD) ; port artnet-TX
NetARM_Teensy_A11: FT1_FTDI.15(TXD) ; port artnet-RX
NetC1_FTDI_2: C1_FTDI.2 F1_FTDI.2 USB1_FTDI.1
NetC2_FTDI_2: C2_FTDI.2 R1_FTDI.1 USB1_FTDI.3
NetC3_FTDI_2: C3_FTDI.2 R2_FTDI.1 USB1_FTDI.2
NetC6_FTDI_1: C6_FTDI.1 FT1_FTDI.1(VCCIO) FT1_FTDI.8(3V3OUT) FT1_FTDI.9(RESET#)
NetFT1_FTDI_6: FT1_FTDI.6(USBDP) R1_FTDI.2
NetFT1_FTDI_7: FT1_FTDI.7(USBDM) R2_FTDI.2

Not connected (* = marked no-connect by the designer): FT1_FTDI 4(CTS#) 5(CBUS2) 11(CBUS1) 12(CBUS0) 14(CBUS3) 16(RTS#); USB1_FTDI 4 6 7 8 9 10 11

### Notes on the sheet
- Title
- Size:
- Date:
- A4
- Number:
- Time:
- Revision:
- Sheet
- of
- File:

### Library data of the parts
C1_FTDI C2_FTDI C3_FTDI C4_FTDI C5_FTDI C6_FTDI = Cap Semi: Capacitor (Semiconductor SIM Model); Published: 8-Jun-2000; LatestRevisionDate: 29-May-2009; LatestRevisionNote: IPC-7351 Footprint Added.; PackageReference: C1206; Publisher: Altium Limited; PackageDescription: Chip Capacitor
F1_FTDI = BLM18PG121SN1D: as F1-120 on sheet Teensy; Datasheet Link: https://www.murata.com/en-us/products/productdetail?partno=BLM18PG121SN1%23; Height: 0.95mm; Manufacturer_Part_Number: BLM18PG121SN1D; Mouser Part Number: 81-BLM18PG121SN1D; Mouser Price/Stock: https://www.mouser.com/Search/Refine.aspx?Keyword=81-BLM18PG121SN1D; RS Part Number: 7241380P; RS Price/Stock: http://uk.rs-online.com/web/p/products/7241380P
FT1_FTDI = FT230XQ-T: Integrated Circuit; Manufacturer_Name: FTDI Chip; Allied_Number: 70403915; Datasheet Link: https://www.ftdichip.com/Support/Documents/DataSheets/ICs/DS_FT230X.pdf; Height: 0.8mm; Manufacturer_Part_Number: FT230XQ-T; Mouser Part Number: 895-FT230XQ-T; Mouser Price/Stock: https://www.mouser.com/Search/Refine.aspx?Keyword=895-FT230XQ-T; RS Part Number: 8888716; RS Price/Stock: http://uk.rs-online.com/web/p/products/8888716; Allied Price/Stock: https://www.alliedelec.com/ftdi-ft230xq-t/70403915/
R1_FTDI R2_FTDI = Res3: Resistor; Published: 8-Jun-2000; LatestRevisionDate: 29-May-2009; LatestRevisionNote: IPC-7351 Footprint Added.; PackageReference: J1-0603; Publisher: Altium Limited; PackageDescription: Chip Resistor
USB1_FTDI = 1050170001: Connector; Manufacturer_Name: Molex; Datasheet Link: http://www.mouser.com/ds/2/276/1050170001_IO_CONNECTORS-230168.pdf; Manufacturer_Part_Number: 1050170001; Mouser Part Number: N/A; Mouser Price/Stock: https://www.mouser.com/Search/Refine.aspx?Keyword=N%2FA

## Sheet Power.SchDoc
size A4; Organization: Altium Limited; Address1: L3, 12a Rodborough Rd; Address2: Frenchs Forest; Address3: NSW; Address4: Australia 2086
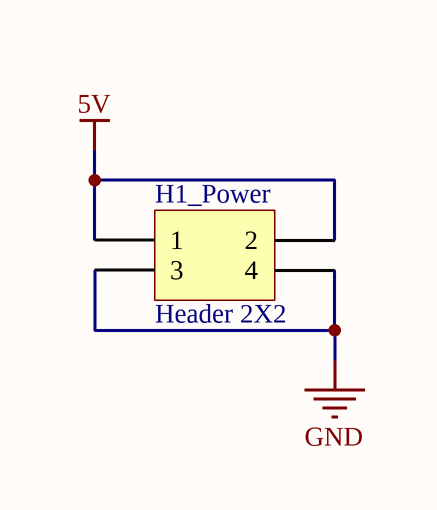
[diagram p5: Power.SchDoc]

### Parts
H1_Power  Header 2X2  [HDR2X2]

### Nets
5V: H1_Power.1 H1_Power.2
GND: H1_Power.3 H1_Power.4

### Notes on the sheet
- Title
- Size:
- Date:
- A4
- Number:
- Time:
- Revision:
- Sheet
- of
- File:

### Library data of the parts
H1_Power = Header 2X2: Header, 2-Pin, Dual row; LatestRevisionDate: 17-Jul-2002; LatestRevisionNote: Re-released for DXP Platform.; Publisher: Altium Limited

## Sheet HallSensor.SchDoc
size A4; Organization: Altium Limited; Address1: L3, 12a Rodborough Rd; Address2: Frenchs Forest; Address3: NSW; Address4: Australia 2086
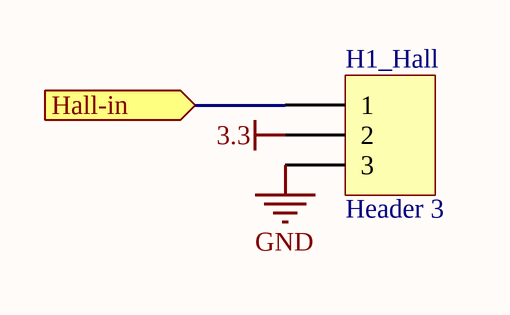
[diagram p6: HallSensor.SchDoc]

### Parts
H1_Hall  Header 3  [HDR1X3]

### Ports
Hall-in

### Nets
3.3: H1_Hall.2
GND: H1_Hall.3
NetARM_Teensy_A8: H1_Hall.1 ; port Hall-in

### Notes on the sheet
- Title
- Size:
- Date:
- A4
- Number:
- Time:
- Revision:
- Sheet
- of
- File:

### Library data of the parts
H1_Hall = Header 3: Header, 3-Pin; LatestRevisionDate: 17-Jul-2002; LatestRevisionNote: Re-released for DXP Platform.; Publisher: Altium Limited

## Sheet CANBUS.SchDoc
size A4; Organization: Altium Limited; Address1: L3, 12a Rodborough Rd; Address2: Frenchs Forest; Address3: NSW; Address4: Australia 2086
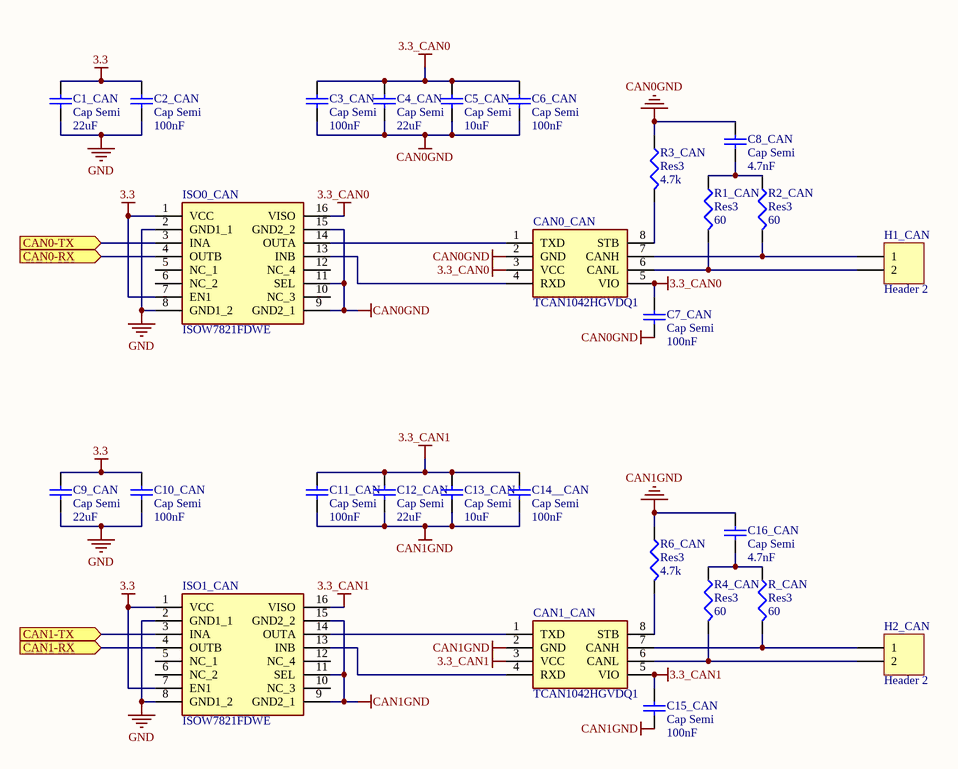
[diagram p7: CANBUS.SchDoc]

### Parts
C1_CAN  Cap Semi  value 22uF  [1608[0603]]
C2_CAN  Cap Semi  value 100nF  [1608[0603]]
C3_CAN  Cap Semi  value 100nF  [1608[0603]]
C4_CAN  Cap Semi  value 22uF  [1608[0603]]
C5_CAN  Cap Semi  value 10uF  [1608[0603]]
C6_CAN  Cap Semi  value 100nF  [1608[0603]]
C7_CAN  Cap Semi  value 100nF  [1608[0603]]
C8_CAN  Cap Semi  value 4.7nF  [1608[0603]]
C9_CAN  Cap Semi  value 22uF  [1608[0603]]
C10_CAN  Cap Semi  value 100nF  [1608[0603]]
C11_CAN  Cap Semi  value 100nF  [1608[0603]]
C12_CAN  Cap Semi  value 22uF  [1608[0603]]
C13_CAN  Cap Semi  value 10uF  [1608[0603]]
C14__CAN  Cap Semi  value 100nF  [1608[0603]]
C15_CAN  Cap Semi  value 100nF  [1608[0603]]
C16_CAN  Cap Semi  value 4.7nF  [1608[0603]]
CAN0_CAN  TCAN1042HGVDQ1  [SOIC127P600X175-8N]
CAN1_CAN  TCAN1042HGVDQ1  [SOIC127P600X175-8N]
H1_CAN  Header 2  [HDR1X2]
H2_CAN  Header 2  [HDR1X2]
ISO0_CAN  ISOW7821FDWE  [SOIC127P1030X265-16N]
ISO1_CAN  ISOW7821FDWE  [SOIC127P1030X265-16N]
R1_CAN  Res3  value 60  [J1-0603]
R2_CAN  Res3  value 60  [J1-0603]
R3_CAN  Res3  value 4.7k  [J1-0603]
R4_CAN  Res3  value 60  [J1-0603]
R6_CAN  Res3  value 4.7k  [J1-0603]
R_CAN  Res3  value 60  [J1-0603]

### Ports
CAN0-RX, CAN0-TX, CAN1-RX, CAN1-TX

### Nets
3.3: C1_CAN.2 C2_CAN.2 C9_CAN.2 C10_CAN.2 ISO0_CAN.1(VCC) ISO0_CAN.7(EN1) ISO1_CAN.1(VCC) ISO1_CAN.7(EN1)
3.3_CAN0: C3_CAN.2 C4_CAN.2 C5_CAN.2 C6_CAN.2 C7_CAN.2 CAN0_CAN.3(VCC) CAN0_CAN.5(VIO) ISO0_CAN.16(VISO)
3.3_CAN1: C11_CAN.2 C12_CAN.2 C13_CAN.2 C14__CAN.2 C15_CAN.2 CAN1_CAN.3(VCC) CAN1_CAN.5(VIO) ISO1_CAN.16(VISO)
CAN0GND: C3_CAN.1 C4_CAN.1 C5_CAN.1 C6_CAN.1 C7_CAN.1 C8_CAN.2 CAN0_CAN.2(GND) ISO0_CAN.9(GND2_1) ISO0_CAN.11(SEL) ISO0_CAN.15(GND2_2) R3_CAN.1
CAN1GND: C11_CAN.1 C12_CAN.1 C13_CAN.1 C14__CAN.1 C15_CAN.1 C16_CAN.2 CAN1_CAN.2(GND) ISO1_CAN.9(GND2_1) ISO1_CAN.11(SEL) ISO1_CAN.15(GND2_2) R6_CAN.1
GND: C1_CAN.1 C2_CAN.1 C9_CAN.1 C10_CAN.1 ISO0_CAN.2(GND1_1) ISO0_CAN.8(GND1_2) ISO1_CAN.2(GND1_1) ISO1_CAN.8(GND1_2)
NetARM_Teensy_J9: ISO0_CAN.4(OUTB) ; port CAN0-RX
NetARM_Teensy_K5: ISO1_CAN.4(OUTB) ; port CAN1-RX
NetARM_Teensy_K9: ISO0_CAN.3(INA) ; port CAN0-TX
NetARM_Teensy_M4: ISO1_CAN.3(INA) ; port CAN1-TX
NetC8_CAN_1: C8_CAN.1 R1_CAN.1 R2_CAN.1
NetC16_CAN_1: C16_CAN.1 R4_CAN.1 R_CAN.1
NetCAN0_CAN_1: CAN0_CAN.1(TXD) ISO0_CAN.14(OUTA)
NetCAN0_CAN_4: CAN0_CAN.4(RXD) ISO0_CAN.13(INB)
NetCAN0_CAN_6: CAN0_CAN.6(CANL) H1_CAN.2 R1_CAN.2
NetCAN0_CAN_7: CAN0_CAN.7(CANH) H1_CAN.1 R2_CAN.2
NetCAN0_CAN_8: CAN0_CAN.8(STB) R3_CAN.2
NetCAN1_CAN_1: CAN1_CAN.1(TXD) ISO1_CAN.14(OUTA)
NetCAN1_CAN_4: CAN1_CAN.4(RXD) ISO1_CAN.13(INB)
NetCAN1_CAN_6: CAN1_CAN.6(CANL) H2_CAN.2 R4_CAN.2
NetCAN1_CAN_7: CAN1_CAN.7(CANH) H2_CAN.1 R_CAN.2
NetCAN1_CAN_8: CAN1_CAN.8(STB) R6_CAN.2

Not connected (* = marked no-connect by the designer): ISO0_CAN 5(NC_1) 6(NC_2) 10(NC_3) 12(NC_4); ISO1_CAN 5(NC_1) 6(NC_2) 10(NC_3) 12(NC_4)

### Notes on the sheet
- Title
- Size:
- Date:
- A4
- Number:
- Time:
- Revision:
- Sheet
- of
- File:

### Library data of the parts
C1_CAN C2_CAN C3_CAN C4_CAN C5_CAN C6_CAN C7_CAN C8_CAN C9_CAN C10_CAN C11_CAN C12_CAN C13_CAN C14__CAN C15_CAN C16_CAN = Cap Semi: Capacitor (Semiconductor SIM Model); Published: 8-Jun-2000; LatestRevisionDate: 29-May-2009; LatestRevisionNote: IPC-7351 Footprint Added.; PackageReference: C1206; Publisher: Altium Limited; PackageDescription: Chip Capacitor
CAN0_CAN CAN1_CAN = TCAN1042HGVDQ1: Integrated Circuit; Manufacturer_Name: Texas Instruments; Datasheet Link: http://www.ti.com/lit/gpn/tcan1042hgv-q1; Height: 1.75mm; Manufacturer_Part_Number: TCAN1042HGVDQ1; Mouser Part Number: 595-TCAN1042HGVDQ1; Mouser Price/Stock: https://www.mouser.com/Search/Refine.aspx?Keyword=595-TCAN1042HGVDQ1; RS Part Number: 1330710P; RS Price/Stock: http://uk.rs-online.com/web/p/products/1330710P
H1_CAN H2_CAN = Header 2: Header, 2-Pin; LatestRevisionDate: 17-Jul-2002; LatestRevisionNote: Re-released for DXP Platform.; Publisher: Altium Limited
ISO0_CAN ISO1_CAN = ISOW7821FDWE: Integrated Circuit; Manufacturer_Name: Texas Instruments; Datasheet Link: http://www.ti.com/lit/ds/symlink/isow7821.pdf; Height: 2.65mm; Manufacturer_Part_Number: ISOW7821FDWE; Mouser Part Number: 595-ISOW7821FDWE; Mouser Price/Stock: https://www.mouser.com/Search/Refine.aspx?Keyword=595-ISOW7821FDWE
R1_CAN R2_CAN R3_CAN R4_CAN R6_CAN R_CAN = Res3: Resistor; Published: 8-Jun-2000; LatestRevisionDate: 29-May-2009; LatestRevisionNote: IPC-7351 Footprint Added.; PackageReference: J1-0603; Publisher: Altium Limited; PackageDescription: Chip Resistor

## Sheet ODrive.SchDoc
size A4; Organization: Altium Limited; Address1: L3, 12a Rodborough Rd; Address2: Frenchs Forest; Address3: NSW; Address4: Australia 2086
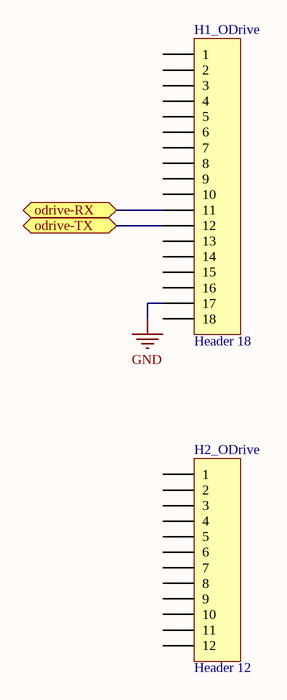
[diagram p8: ODrive.SchDoc]

### Parts
H1_ODrive  Header 18  [HDR1X18]
H2_ODrive  Header 12  [HDR1X12]

### Ports
odrive-RX, odrive-TX

### Nets
GND: H1_ODrive.17
NetH1_ODrive_11: H1_ODrive.11 ; port odrive-RX
NetH1_ODrive_12: H1_ODrive.12 ; port odrive-TX

Not connected (* = marked no-connect by the designer): H1_ODrive 1 2 3 4 5 6 7 8 9 10 13 14 15 16 18; H2_ODrive 1 2 3 4 5 6 7 8 9 10 11 12

### Notes on the sheet
- Title
- Size:
- Date:
- A4
- Number:
- Time:
- Revision:
- Sheet
- of
- File:

### Library data of the parts
H1_ODrive = Header 18: Header, 18-Pin; LatestRevisionDate: 17-Jul-2002; LatestRevisionNote: Re-released for DXP Platform.; Publisher: Altium Limited
H2_ODrive = Header 12: Header, 12-Pin; LatestRevisionDate: 17-Jul-2002; LatestRevisionNote: Re-released for DXP Platform.; Publisher: Altium Limited

## Sheet RZ120.SchDoc
size A4; Organization: Altium Limited; Address1: L3, 12a Rodborough Rd; Address2: Frenchs Forest; Address3: NSW; Address4: Australia 2086
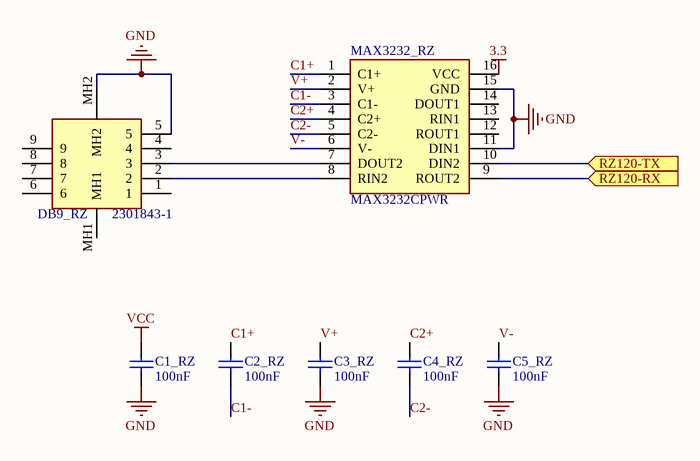
[diagram p9: RZ120.SchDoc]

### Parts
C1_RZ  value 100nF  [1608[0603]]  (hidden comment: Cap Semi)
C2_RZ  value 100nF  [1608[0603]]  (hidden comment: Cap Semi)
C3_RZ  value 100nF  [1608[0603]]  (hidden comment: Cap Semi)
C4_RZ  value 100nF  [1608[0603]]  (hidden comment: Cap Semi)
C5_RZ  value 100nF  [1608[0603]]  (hidden comment: Cap Semi)
DB9_RZ  2301843-1  [23018431]
MAX3232_RZ  MAX3232CPWR  [SOP65P640X120-16N]

### Ports
RZ120-RX, RZ120-TX

### Nets
3.3: MAX3232_RZ.16(VCC)
GND: C1_RZ.1 C3_RZ.1 C5_RZ.1 DB9_RZ.5 DB9_RZ.MH2 MAX3232_RZ.11(DIN1) MAX3232_RZ.15(GND)
VCC: C1_RZ.2
C1+: C2_RZ.2 MAX3232_RZ.1(C1+)
C1-: C2_RZ.1 MAX3232_RZ.3(C1-)
C2+: C4_RZ.2 MAX3232_RZ.4(C2+)
C2-: C4_RZ.1 MAX3232_RZ.5(C2-)
V+: C3_RZ.2 MAX3232_RZ.2(V+)
V-: C5_RZ.2 MAX3232_RZ.6(V-)
NetDB9_RZ_2: DB9_RZ.2 MAX3232_RZ.8(RIN2)
NetDB9_RZ_3: DB9_RZ.3 MAX3232_RZ.7(DOUT2)
NetMAX3232_RZ_9: MAX3232_RZ.9(ROUT2) ; port RZ120-RX
NetMAX3232_RZ_10: MAX3232_RZ.10(DIN2) ; port RZ120-TX

Not connected (* = marked no-connect by the designer): DB9_RZ 1 4 6 7 8 9 MH1; MAX3232_RZ 12(ROUT1) 13(RIN1) 14(DOUT1)

### Notes on the sheet
- Title
- Size:
- Date:
- A4
- Number:
- Time:
- Revision:
- Sheet
- of
- File:

### Library data of the parts
C1_RZ C2_RZ C3_RZ C4_RZ C5_RZ = Cap Semi: Capacitor (Semiconductor SIM Model); Published: 8-Jun-2000; LatestRevisionDate: 29-May-2009; LatestRevisionNote: IPC-7351 Footprint Added.; PackageReference: C1206; Publisher: Altium Limited; PackageDescription: Chip Capacitor
DB9_RZ = 2301843-1: Connector; Manufacturer_Name: TE Connectivity; Datasheet Link: https://componentsearchengine.com/Datasheets/2/2301843-1.pdf; Height: 13.955mm; Manufacturer_Part_Number: 2301843-1; Mouser Part Number: 571-2301843-1; Mouser Price/Stock: https://www.mouser.com/Search/Refine.aspx?Keyword=571-2301843-1
MAX3232_RZ = MAX3232CPWR: Integrated Circuit; Manufacturer_Name: Texas Instruments; Datasheet Link: http://www.ti.com/lit/gpn/max3232; Height: 1.2mm; Manufacturer_Part_Number: MAX3232CPWR; Mouser Part Number: 595-MAX3232CPWR; Mouser Price/Stock: https://www.mouser.com/Search/Refine.aspx?Keyword=595-MAX3232CPWR

## Sheet PowerOld.SchDoc
size A4; Organization: Altium Limited; Address1: L3, 12a Rodborough Rd; Address2: Frenchs Forest; Address3: NSW; Address4: Australia 2086
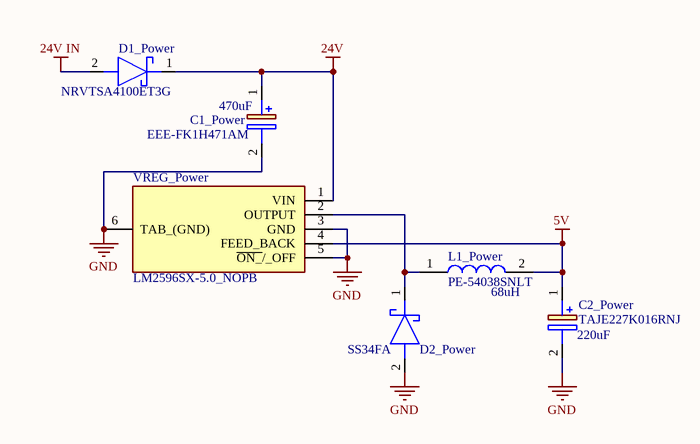
[diagram p10: PowerOld.SchDoc]

### Parts
C1_Power  EEE-FK1H471AM  value 470uF  [CAPAE1700X1700N]
C2_Power  TAJE227K016RNJ  value 220uF  [CAPPM7344X430N]
D1_Power  NRVTSA4100ET3G  [DIOM5226X220N]
D2_Power  SS34FA  [SODFL3618X143N]
L1_Power  PE-54038SNLT  value 68uH  [HCI-68]
VREG_Power  LM2596SX-5.0_NOPB  [KTT0005B]

### Nets
5V: C2_Power.1(+) L1_Power.2 VREG_Power.4(FEED_BACK)
24V: C1_Power.1(+) D1_Power.1(K) VREG_Power.1(VIN)
24V IN: D1_Power.2(A)
GND: C1_Power.2(-) C2_Power.2(-) D2_Power.2(A) VREG_Power.3(GND) VREG_Power.5(~{ON_}/_OFF) VREG_Power.6(TAB_(GND))
NetD2_Power_1: D2_Power.1(K) L1_Power.1 VREG_Power.2(OUTPUT)

### Notes on the sheet
- Title
- Size:
- Date:
- A4
- Number:
- Time:
- Revision:
- Sheet
- of
- File:

### Library data of the parts
C1_Power = EEE-FK1H471AM: Capacitor Polarised; Manufacturer_Name: Panasonic; Allied_Number: 70258116; Datasheet Link: https://industrial.panasonic.com/cdbs/www-data/pdf/RDE0000/ABA0000C1178.pdf; Height: 17mm; Manufacturer_Part_Number: EEE-FK1H471AM; Mouser Part Number: 667-EEE-FK1H471AM; Mouser Price/Stock: https://www.mouser.com/Search/Refine.aspx?Keyword=667-EEE-FK1H471AM; Allied Price/Stock: https://www.alliedelec.com/panasonic-eee-fk1h471am/70258116/
C2_Power = TAJE227K016RNJ: Capacitor Polarised; Manufacturer_Name: AVX; Allied_Number: 70475119; Datasheet Link: http://datasheets.avx.com/TAJ.pdf; Height: 4.3mm; Manufacturer_Part_Number: TAJE227K016RNJ; Mouser Part Number: 581-TAJE227K016R; Mouser Price/Stock: https://www.mouser.com/Search/Refine.aspx?Keyword=581-TAJE227K016R; RS Part Number: 1355452P; RS Price/Stock: http://uk.rs-online.com/web/p/products/1355452P; Allied Price/Stock: https://www.alliedelec.com/avx-taje227k016rnj/70475119/
D1_Power = NRVTSA4100ET3G: Schottky Diode; Manufacturer_Name: ON Semiconductor; Datasheet Link: http://www.onsemi.com/pub/Collateral/NRVTSA4100E-D.PDF; Height: 2.2mm; Manufacturer_Part_Number: NRVTSA4100ET3G; Mouser Part Number: 863-NRVTSA4100ET3G; Mouser Price/Stock: https://www.mouser.com/Search/Refine.aspx?Keyword=863-NRVTSA4100ET3G; RS Part Number: 1413561P; RS Price/Stock: http://uk.rs-online.com/web/p/products/1413561P
D2_Power = SS34FA: Schottky Diode; Manufacturer_Name: ON Semiconductor; Datasheet Link: http://www.onsemi.com/pub/Collateral/SS36FA-D.pdf; Height: 1.43mm; Manufacturer_Part_Number: SS34FA; Mouser Part Number: 512-SS34FA; Mouser Price/Stock: https://www.mouser.com/Search/Refine.aspx?Keyword=512-SS34FA; RS Part Number: 1841417; RS Price/Stock: http://uk.rs-online.com/web/p/products/1841417
L1_Power = PE-54038SNLT: Inductor; Manufacturer_Name: Pulse; Datasheet Link: https://productfinder.pulseeng.com/products/datasheets/SPM2007_47.pdf; Manufacturer_Part_Number: PE-54038SNLT; Mouser Part Number: 673-PE-54038SNLT; Mouser Price/Stock: https://www.mouser.com/Search/Refine.aspx?Keyword=673-PE-54038SNLT; RS Part Number: 7428262; RS Price/Stock: https://uk.rs-online.com/web/p/products/7428262
VREG_Power = LM2596SX-5.0_NOPB: Integrated Circuit; Manufacturer_Name: Texas Instruments; Manufacturer_Part_Number: LM2596SX-5.0/NOPB; Datasheet Link: http://www.ti.com/lit/gpn/lm2596; Mouser Part Number: 926-LM2596SX-5.0NOPB; Mouser Price/Stock: https://www.mouser.com/Search/Refine.aspx?Keyword=926-LM2596SX-5.0NOPB

## Nets that join several sheets
3.3: Teensy (18 pins), Fans (H4-1_Fans.1 H5-1_Fans.1 H5-1_Fans.2), HallSensor (H1_Hall.2), CANBUS (8 pins), RZ120 (MAX3232_RZ.16)
5V: Teensy (D2.2 R6.2), LEDRing (C1_LED.2 H1_LED.3 LS1_LED.14), Fans (C1_Fans.2 C2_Fans.2 MD1_Fans.1 MD2_Fans.1), FTDI (C4_FTDI.2 C5_FTDI.2 F1_FTDI.1 FT1_FTDI.10), Power (H1_Power.1 H1_Power.2), PowerOld (C2_Power.1 L1_Power.2 VREG_Power.4)
24V: Fans (D1_Fans.1 D2_Fans.1), PowerOld (C1_Power.1 D1_Power.1 VREG_Power.1)
GND: Teensy (34 pins), LEDRing (10 pins), Fans (10 pins), FTDI (10 pins), Power (H1_Power.3 H1_Power.4), HallSensor (H1_Hall.3), CANBUS (8 pins), ODrive (H1_ODrive.17), RZ120 (7 pins), PowerOld (6 pins)
VCC: Teensy (C14.2 POR1_Teensy.2), RZ120 (C1_RZ.2)
NetARM_Teensy_A5: Teensy (ARM_Teensy.A5), LEDRing (LS1_LED.2)
NetARM_Teensy_A8: Teensy (ARM_Teensy.A8), HallSensor (H1_Hall.1)
NetARM_Teensy_A9: Teensy (ARM_Teensy.A9), FTDI (FT1_FTDI.2)
NetARM_Teensy_A11: Teensy (ARM_Teensy.A11), FTDI (FT1_FTDI.15)
NetARM_Teensy_D11: Teensy (ARM_Teensy.D11), Fans (MD2_Fans.6)
NetARM_Teensy_D12: Teensy (ARM_Teensy.D12), Fans (MD1_Fans.6)
NetARM_Teensy_G11: Teensy (ARM_Teensy.G11), Fans (H4-1_Fans.2 H5-1_Fans.3)
NetARM_Teensy_G12: Teensy (ARM_Teensy.G12), Fans (H4-1_Fans.3 H5-1_Fans.4)
NetARM_Teensy_J9: Teensy (ARM_Teensy.J9), CANBUS (ISO0_CAN.4)
NetARM_Teensy_K5: Teensy (ARM_Teensy.K5), CANBUS (ISO1_CAN.4)
NetARM_Teensy_K9: Teensy (ARM_Teensy.K9), CANBUS (ISO0_CAN.3)
NetARM_Teensy_M4: Teensy (ARM_Teensy.M4), CANBUS (ISO1_CAN.3)